# EAGLE design RfidReader (EAGLE 6.5.0)
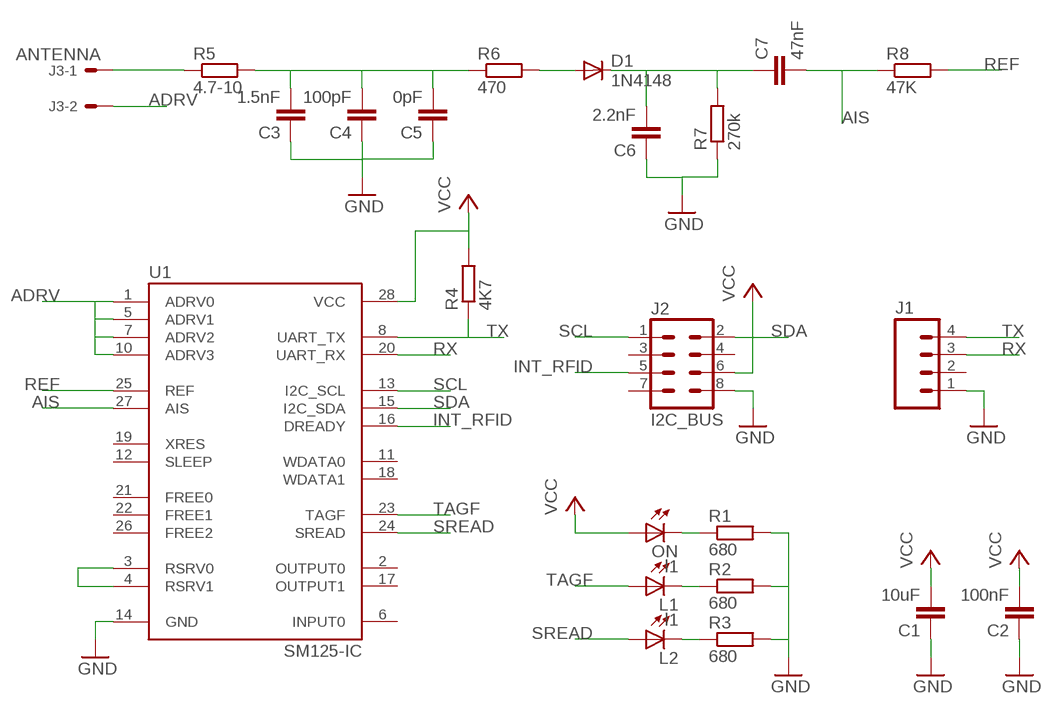
[diagram p0: schematic, sheet 1]

## Parts
C1  10uF  C-EUC0805  [C0805]
C2  100nF  C-EUC0805  [C0805]
C3  1.5nF  C-EUC0805  [C0805]
C4  100pF  C-EUC0805  [C0805]
C5  0pF  C-EUC0805  [C0805]
C6  2.2nF  C-EUC0805  [C0805]
C7  47nF  C-EUC0805  [C0805]
D1  1N4148  [D0805]
J1  M04PTH  [1X04]
J2  I2C_BUS  IDC-SOCKET04X2IDC_SOCKECT04X2_ANGLE  [SOCKET04X2_ANGLE]
J3  ANTENNA  22-05-7028-02  [7395-02]
L1  l1  LEDCHIPLED_0805  [CHIPLED_0805]
L2  LEDCHIPLED_0805  [CHIPLED_0805]
ON  l1  LEDCHIPLED_0805  [CHIPLED_0805]
R1  680  R-EU_M0805  [M0805]
R2  680  R-EU_M0805  [M0805]
R3  680  R-EU_M0805  [M0805]
R4  4K7  R-EU_M0805  [M0805]
R5  4.7-10  R-EU_M0805  [M0805]
R6  470  R-EU_M0805  [M0805]
R7  270k  R-EU_M0805  [M0805]
R8  47K  R-EU_M0805  [M0805]
U1  SM125-IC  [SOIC28]

## Nets
ADRV: J3.2 U1.1(ADRV0) U1.5(ADRV1) U1.7(ADRV2) U1.10(ADRV3)
AIS: C7.2 R8.1 U1.27(AIS)
GND: C1.1 C2.1 C3.1 C4.1 C5.1 C6.1 J1.1 J2.8 R1.2 R2.2 R3.2 R7.1 U1.14(GND)
INT_RFID: J2.5 U1.16(DREADY)
N$1: C3.2 C4.2 C5.2 R5.2 R6.1
N$2: C6.2 C7.1 D1.C R7.2
N$3: D1.A R6.2
N$4: U1.3(RSRV0) U1.4(RSRV1)
N$6: J3.1 R5.1
N$7: ON.C R1.1
N$14: L1.C R2.1
N$15: L2.C R3.1
REF: R8.2 U1.25(REF)
RX: J1.3 U1.20(UART_RX)
SCL: J2.1 U1.13(I2C_SCL)
SDA: J2.2 U1.15(I2C_SDA)
SREAD: L2.A U1.24(SREAD)
TAGF: L1.A U1.23(TAGF)
TX: J1.4 R4.1 U1.8(UART_TX)
VCC: C1.2 C2.2 J2.6 ON.A R4.2 U1.28(VCC)
Unconnected: J1.2 J2.3 J2.4 J2.7 U1.2(OUTPUT0) U1.6(INPUT0) U1.11(WDATA0) U1.12(SLEEP) U1.17(OUTPUT1) U1.18(WDATA1) U1.19(XRES) U1.21(FREE0) U1.22(FREE1) U1.26(FREE2)

## Library data of the parts
C1-C7 = resistor:C-EU: CAPACITOR, European symbol
D1 = diode:1N4148: DIODE high speed (Philips)
J1 = SparkFun-Connectors:M04: Header 4 Standard 4-pin 0.1" header. Use with straight break away headers (SKU : PRT-00116), right angle break away headers (PRT-00553), swiss pins (PRT-00743), machine pins (PRT-00117), and female headers (PRT-00115). Molex polarized connector foot print use with SKU : PRT-08231 with associated crimp pins and housings. 1MM SMD Version SKU: PRT-10208
J2 = Connectors:IDC-SOCKET04X2
J3 = con-molex:22-?-02: CONNECTOR wire to board 2.54 mm (.1 inch) pitch header; OC_FARNELL: 9731601; OC_NEWARK: unknown
L1 L2 ON = led:LED: LED OSRAM: - CHIPLED LG R971, LG N971, LY N971, LG Q971, LY Q971, LO R971, LY R971 LH N974, LH R974 LS Q976, LO Q976, LY Q976 LO Q996 - Hyper CHIPLED LW Q18S LB Q993, LB Q99A, LB R99A - SideLED LS A670, LO A670, LY A670, LG A670, LP A670 LB A673, LV A673, LT A673, LW A673 LH A674 LY A675 LS A676, LA A676, LO A676, LY A676, LW A676 LS A679, LY A679, LG A679 - Hyper Micro SIDELED® LS Y876, LA Y876, LO Y876, LY Y876 LT Y87S - SmartLED LW L88C, LW L88S LB L89C, LB L89S, LG L890 LS L89K, LO L89K, LY L89K LS L896, LA L896, LO L896, LY L896 - TOPLED LS T670, LO T670, LY T670, LG T670, LP T670 LSG T670, LSP T670, LSY T670, LOP T670, LYG T670 LG T671, LOG T671, LSG T671 LB T673, LV T673, LT T673, LW T673 LH T674 LS T676, LA T676, LO T676, LY T676, LB T676, LH T676, LSB T676, LW T676 LB T67C, LV T67C, LT T67C, LS T67K, LO T67K, LY T67K, LW E67C LS E67B, LA E67B, LO E67B, LY E67B, LB E67C, LV E67C, LT E67C LW T67C LS T679, LY T679, LG T679 LS T770, LO T770, LY T770, LG T770, LP T770 LB T773, LV T773, LT T773, LW T773 LH T774 LS E675, LA E675, LY E675, LS T675 LS T776, LA T776, LO T776, LY T776, LB T776 LHGB T686 LT T68C, LB T68C - Hyper Mini TOPLED® LB M676 - Mini TOPLED Santana® LG M470 LS M47K, LO M47K, LY M47K Source: http://www.osram.convergy.de LUXEON: - LUMILED® LXK2-PW12-R00, LXK2-PW12-S00, LXK2-PW14-U00, LXK2-PW14-V00 LXK2-PM12-R00, LXK2-PM12-S00, LXK2-PM14-U00 LXK2-PE12-Q00, LXK2-PE12-R00, LXK2-PE12-S00, LXK2-PE14-T00, LXK2-PE14-U00 LXK2-PB12-K00, LXK2-PB12-L00, LXK2-PB12-M00, LXK2-PB14-N00, LXK2-PB14-P00, LXK2-PB14-Q00 LXK2-PR12-L00, LXK2-PR12-M00, LXK2-PR14-Q00, LXK2-PR14-R00 LXK2-PD12-Q00, LXK2-PD12-R00, LXK2-PD12-S00 LXK2-PH12-R00, LXK2-PH12-S00 LXK2-PL12-P00, LXK2-PL12-Q00, LXK2-PL12-R00 Source: www.luxeon.com KINGBRIGHT: KA-3528ASYC Source: www.kingbright.com
R1-R8 = resistor:R-EU_: RESISTOR, European symbol
U1 = Sonmicro:SM125-IC

## Board
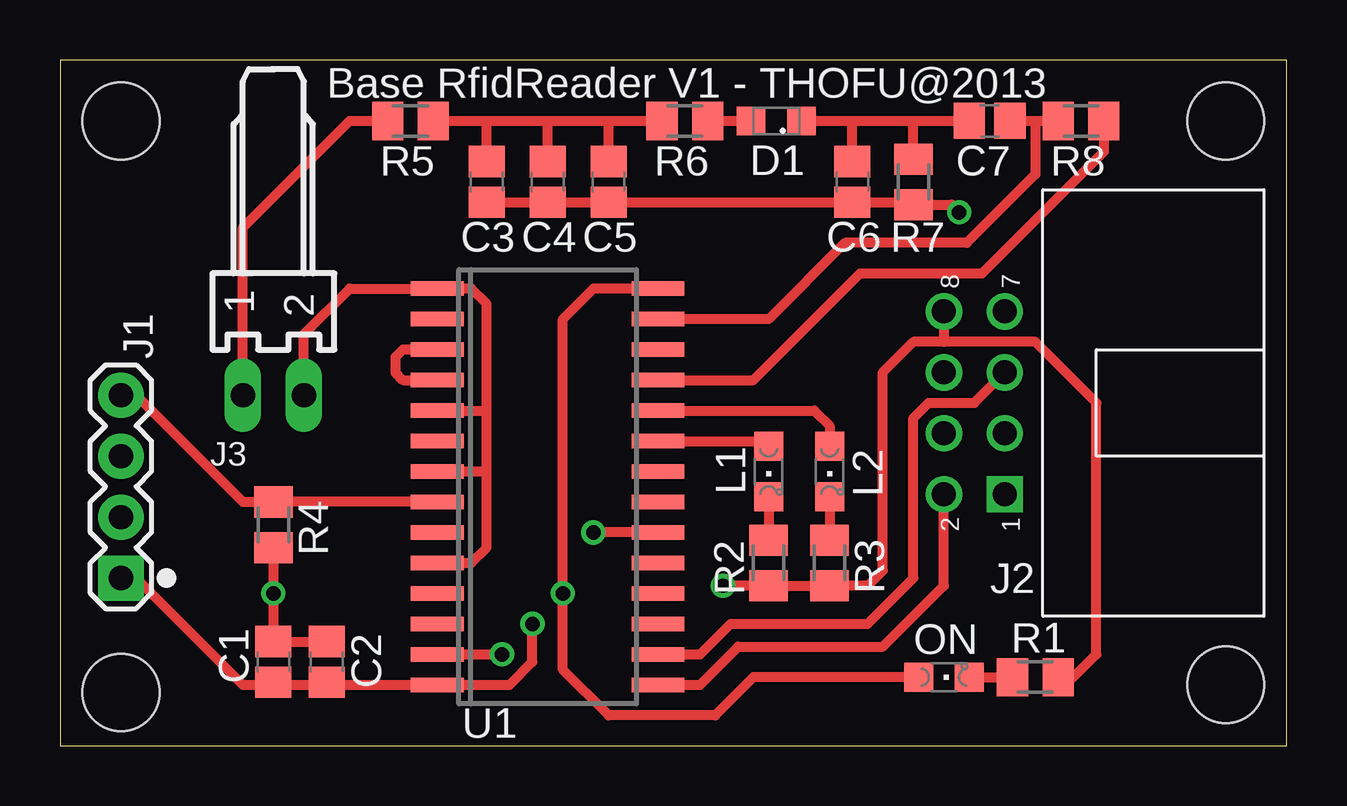
[diagram p1: board, top side]
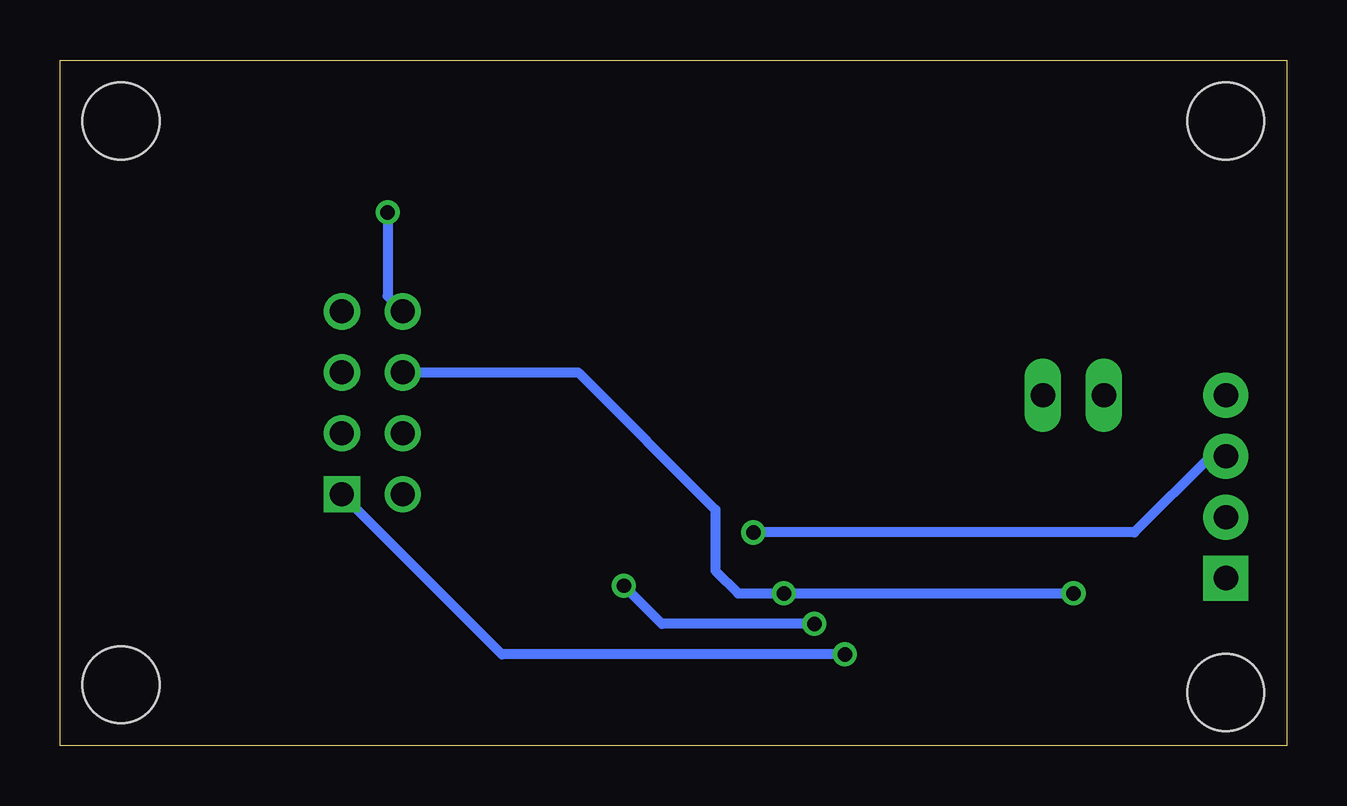
[diagram p2: board, bottom side, seen from below]

Size 51.12 x 28.57 mm. Coordinates in mm from the lower left corner, seen from the top.
Outline: 0,28.57 0,0 51.12,0 51.12,28.57 0,28.57
Copper layers (1*16): Top 0.035mm / dielectric 1.5mm / Bottom 0.035mm
Design rules "default": minimum track width 10mil, minimum drill 24mil, track to track 8mil, track to pad 8mil, pad to pad 8mil, via to via 8mil, smd to smd 8mil, copper to edge 40mil, drill to drill 8mil, minimum pad ring 10mil, minimum via ring 8mil, stop-mask expansion 4mil, vias tented up to drill 0mil, thermal gap 10mil
Holes 3.2 mm at 2.54,26.04 48.58,26.04 48.58,2.54 2.54,2.22

### Footprints (pad centres in the part's own frame; a part is rotated, then mirrored left to right if it is on the bottom)
C0805 = smd 1.3 x 1.5: 1 -0.85,0; 2 0.85,0
D0805 = smd 1.2 x 1.2: A 1.05,0; C -1.05,0
1X04 = drill 1.016 pad 1.88 square: 1 0,0 | drill 1.016 pad 1.88: 2 2.54,0; 3 5.08,0; 4 7.62,0
SOCKET04X2_ANGLE = drill 1 square: 1 -3.81,-1.27 | drill 1: 2 -3.81,1.27; 3 -1.27,-1.27; 4 -1.27,1.27; 5 1.27,-1.27; 6 1.27,1.27; 7 3.81,-1.27; 8 3.81,1.27
7395-02 = drill 1.016 long: 1 1.27,0; 2 -1.27,0
CHIPLED_0805 = smd 1.2 x 1.2: A 0,-1.05; C 0,1.05
M0805 = smd 1.3 x 1.6: 1 -0.95,0; 2 0.95,0
SOIC28 = smd 0.6 x 2.2: 1 -8.255,-4.6; 2 -6.985,-4.6; 3 -5.715,-4.6; 4 -4.445,-4.6; 5 -3.175,-4.6; 6 -1.905,-4.6; 7 -0.635,-4.6; 8 0.635,-4.6; 9 1.905,-4.6; 10 3.175,-4.6; 11 4.445,-4.6; 12 5.715,-4.6; 13 6.985,-4.6; 14 8.255,-4.6; 15 8.255,4.6; 16 6.985,4.6; 17 5.715,4.6; 18 4.445,4.6; 19 3.175,4.6; 20 1.905,4.6; 21 0.635,4.6; 22 -0.635,4.6; 23 -1.905,4.6; 24 -3.175,4.6; 25 -4.445,4.6; 26 -5.715,4.6; 27 -6.985,4.6; 28 -8.255,4.6

### Placement (x,y rotation side)
C1  8.89,3.49 90 top
C2  11.11,3.49 90 top
C3  17.78,23.5 90 top
C4  20.32,23.5 90 top
C5  22.86,23.5 90 top
C6  33.02,23.5 90 top
C7  38.73,26.04 0 top
D1  29.84,26.04 180 top
J1  2.54,6.99 90 top
J2  38.1,14.29 90 top
J3  8.89,14.61 180 top
L1  29.53,11.43 180 top
L2  32.07,11.43 180 top
ON  36.83,2.86 270 top
R1  40.64,2.86 0 top
R2  29.53,7.62 270 top
R3  32.07,7.62 270 top
R4  8.89,9.21 270 top
R5  14.61,26.04 0 top
R6  26.04,26.04 0 top
R7  35.56,23.5 90 top
R8  42.55,26.04 0 top
U1  20.32,10.79 270 top

### Tracks (layer width: path | path; a pad name or v marks a point on that pad's centre or on a via)
ADRV
  Top 0.406: U1.10 17.14,7.62 17.78,8.26 17.78,11.43 | 17.78,11.43 17.78,13.97 | 17.78,13.97 17.78,18.41 17.14,19.05 U1.1 12.06,19.05 10.16,17.14 J3.2 | U1.7 17.78,11.43 | U1.5 17.78,13.97
AIS
  Top 0.406: 40.64,26.04 R8.1 | C7.2 40.64,26.04 | 40.64,26.04 40.64,23.81 37.78,20.95 32.7,20.95 29.53,17.78 U1.27
GND  (via drill 0.6)
  Top 0.406: C3.1 C4.1 C5.1 C6.1 35.46,22.64 R7.1 37.15,22.55 v37.47,22.23 | J1.1 3.17,6.99 7.62,2.54 8.89,2.54 | 8.89,2.54 10.79,2.54 | 10.79,2.54 U1.14 18.73,2.54 19.68,3.49 v19.68,5.08 | 8.89,2.54 C1.1 | C2.1 10.79,2.64 10.79,2.54 | v27.62,6.67 R2.2 R3.2 33.66,6.67 34.29,7.3 34.29,15.56 35.56,16.83 36.83,16.83 | R1.2 42.23,2.86 43.18,3.81 43.18,14.29 40.64,16.83 36.83,16.83 | J2.8 36.83,16.83
  Bottom 0.406: v37.47,22.23 37.47,18.73 J2.8 | v19.68,5.08 26.04,5.08 v27.62,6.67
INT_RFID
  Top 0.406: J2.5 38.1,14.29 36.2,14.29 35.56,13.65 35.56,6.99 33.66,5.08 27.94,5.08 26.67,3.81 U1.16
N$1
  Top 0.406: R5.2 17.78,26.04 | 17.78,26.04 20.32,26.04 | 20.32,26.04 22.86,26.04 | 22.86,26.04 R6.1 | C5.2 22.86,26.04 | C4.2 20.32,26.04 | C3.2 17.78,26.04
N$2
  Top 0.406: D1.C 33.02,26.04 | 33.02,26.04 35.56,26.04 | 35.56,26.04 C7.1 | C6.2 33.02,26.04 | R7.2 35.56,26.04
N$3
  Top 0.406: R6.2 D1.A
N$4
  Top 0.406: U1.3 14.29,16.51 13.97,16.19 13.97,15.56 14.29,15.24 U1.4
N$6
  Top 0.406: R5.1 12.06,26.04 7.62,21.59 J3.1
N$7
  Top 0.406: ON.C R1.1
N$14
  Top 0.406: L1.C R2.1
N$15
  Top 0.406: L2.C R3.1
REF
  Top 0.406: R8.2 43.49,24.76 38.42,19.68 33.34,19.68 28.89,15.24 U1.25
RX  (via drill 0.6)
  Top 0.406: U1.20 v22.23,8.89
  Bottom 0.406: v22.23,8.89 6.35,8.89 3.17,12.06 J1.3
SCL  (via drill 0.6)
  Top 0.406: U1.13 v18.41,3.81
  Bottom 0.406: v18.41,3.81 32.7,3.81 J2.1
SDA
  Top 0.406: J2.2 36.83,6.67 34.29,4.13 28.26,4.13 26.67,2.54 U1.15
SREAD
  Top 0.406: U1.24 31.43,13.97 32.07,13.34 L2.A
TAGF
  Top 0.406: U1.23 29.43,12.7 L1.A
TX
  Top 0.406: U1.8 9.53,10.16 | R4.1 9.53,10.16 | J1.4 3.17,14.61 7.62,10.16 9.53,10.16
VCC  (via drill 0.6)
  Top 0.406: C2.2 C1.2 v8.89,6.35 R4.2 | U1.28 22.23,19.05 20.95,17.78 v20.95,6.35 20.95,3.17 22.86,1.27 27.3,1.27 28.89,2.86 ON.A
  Bottom 0.406: v8.89,6.35 v20.95,6.35 22.86,6.35 23.81,7.3 23.81,9.84 29.53,15.56 J2.6

### Text on the board
tNames: Base RfidReader V1 - THOFU@2013